# EAGLE schematic Dimmer Circuit (EAGLE 9.4.2)
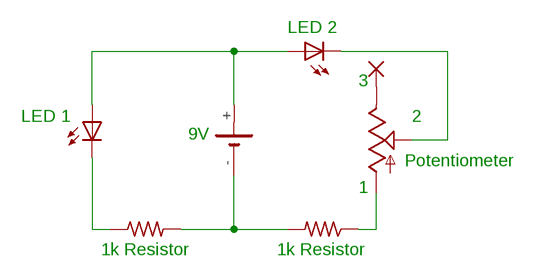
[diagram p0: schematic, sheet 1]

## Parts
G1  SL-150-1/2AA/PR  [SL-150-1/2AA/PR]
LED1  LAP4-BOTTOM  [P47F-BOTTOM]
LED2  LAP4-BOTTOM  [P47F-BOTTOM]
PAD1  2,15/1,0  [2,15/1,0]
R1  R-US_0204/2V  [0204V]
R2  R-US_0204/2V  [0204V]
R3  TRIM_US-ECP10S  [ECP10S]

## Nets
N$1: G1.- R1.2 R2.2
N$2: LED1.C R2.1
N$3: G1.+ LED1.A LED2.A
N$4: LED2.C R3.S
N$5: R1.1 R3.A
N$6: PAD1.1(P) R3.E

## Notes on the sheet
- LED 2
- 3
- LED 1 | 2
- 9V
- Potentiometer
- 1
- 1k Resistor | 1k Resistor

## Library data of the parts
G1 = battery:SL-150-1/2AA/PR: LI BATTERY Sonnenschein
LED1 LED2 = led:*P4: PointLED® Enhanced Thinfilm LED TOP & BOTTOM mount LS P47F, LR P47F, LA P47F, LY P47F, LT P4SG, LB P4SG, LW P4SG Source: http://catalog.osram-os.com .. LA_LR_LS_LY_P47F_Pb_free.pdf
PAD1 = wirepad:2,15/1,0: THROUGH-HOLE PAD
R1 R2 = rcl:R-US_: RESISTOR, American symbol
R3 = pot:TRIM_US-: POTENTIOMETER